# EAGLE schematic div71-eagle (EAGLE 6.5.0)
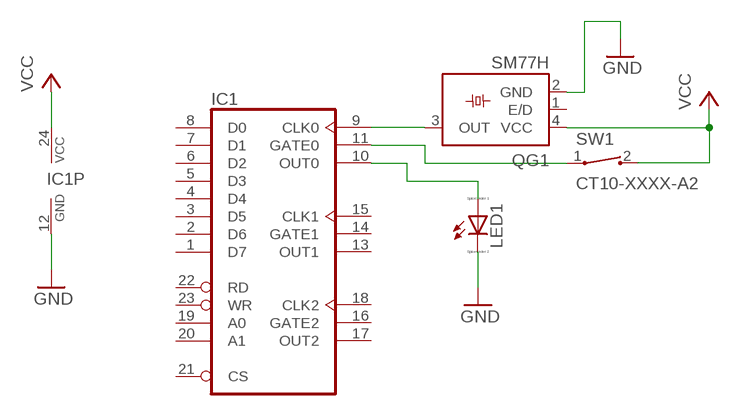
[diagram p0: schematic, sheet 1]

## Parts
IC1  8253  [DIL24-6]
LED1  LED_E  [LED_1206]
QG1  SM77H  [SM77H]
SW1  CT10-XXXX-A2  [CT10-XXXX-A2]

## Nets
GND: IC1.12(GND) LED1.C QG1.2(GND)
N$1: IC1.9(CLK0) QG1.3(OUT)
N$2: IC1.11(GATE0) SW1.1
N$3: IC1.10(OUT0) LED1.A
VCC: IC1.24(VCC) QG1.4(VCC) SW1.2
Unconnected: IC1.1(D7) IC1.2(D6) IC1.3(D5) IC1.4(D4) IC1.5(D3) IC1.6(D2) IC1.7(D1) IC1.8(D0) IC1.13(OUT1) IC1.14(GATE1) IC1.15(CLK1) IC1.16(GATE2) IC1.17(OUT2) IC1.18(CLK2) IC1.19(A0) IC1.20(A1) IC1.21(CS) IC1.22(RD) IC1.23(WR) QG1.1(E/D)

## Library data of the parts
IC1 = micro-intel:8253: MICROCOMPUTER/PERIPHERAL DEVICE; OC_FARNELL: unknown; OC_NEWARK: unknown
LED1 = eagle-ltspice:LED_E: LED Source: http://www.osram.convergy.de Source: www.luxeon.com Source: www.kingbright.com; SPICEMODEL: NONE; SPICEPREFIX: D; SPICETYPE: diode
QG1 = crystal:SM77H: 3.3V CMOS Clock Oscillator Source: www.pletronics.com .. sm77h%203.3v.pdf; OC_FARNELL: unknown; OC_NEWARK: unknown
SW1 = switch-coto:CT10-XXXX-: CT10 Series Molded Switch Source: www.cotorelay.com .. Coto_Technology__CT10-1530-G1.pdf